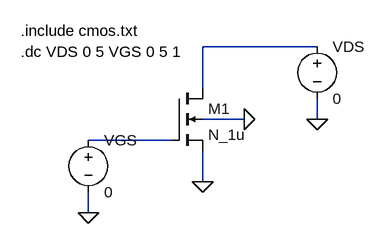
[diagram p0: schematic lab3_zad1.asc]
lab3_zad1.asc, the LTspice schematic file:
Version 4
SHEET 1 880 680
WIRE 352 48 176 48
WIRE 176 112 176 48
WIRE 240 160 176 160
WIRE 352 160 352 128
WIRE 128 192 0 192
WIRE 176 256 176 208
WIRE 0 304 0 272
FLAG 176 256 0
FLAG 240 160 0
FLAG 352 160 0
FLAG 0 304 0
SYMBOL nmos4 128 112 R0
SYMATTR InstName M1
SYMATTR Value N_1u
SYMATTR Value2 l=1u w=5u
SYMBOL voltage 0 176 R0
WINDOW 123 0 0 Left 0
WINDOW 39 0 0 Left 0
SYMATTR InstName VGS
SYMATTR Value 0
SYMBOL voltage 352 32 R0
WINDOW 123 0 0 Left 0
WINDOW 39 0 0 Left 0
SYMATTR InstName VDS
SYMATTR Value 0
TEXT -104 24 Left 2 !.include cmos.txt
TEXT -104 56 Left 2 !.dc VDS 0 5 VGS 0 5 1

The netlist it stands for:
* lab3_zad1.asc
M1 N001 N002 0 0 N_1u l=1u w=5u
VGS N002 0 0
VDS N001 0 0
.model NMOS NMOS
.model PMOS PMOS
.lib standard.mos
.include cmos.txt
.dc VDS 0 5 VGS 0 5 1
.backanno
.end